# EAGLE design lpc812 (EAGLE 6.4)
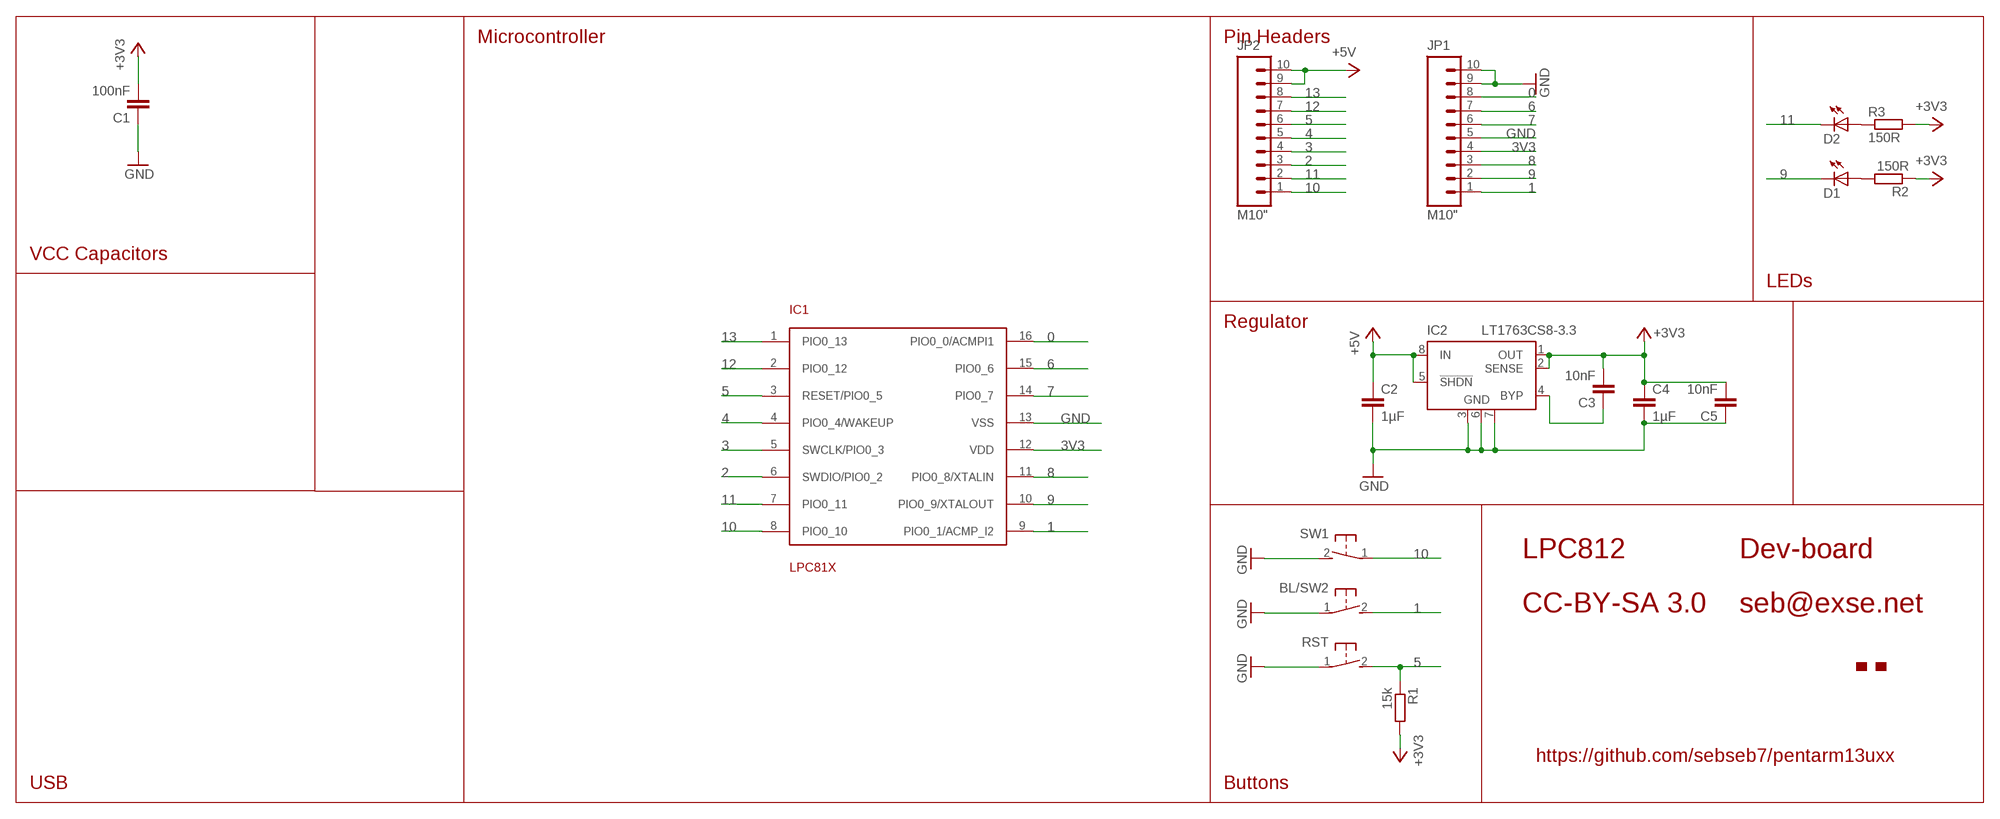
[diagram p0: schematic, sheet 1]

## Parts
BL/SW2  SWITCH_MCTAEF  [SWITCH_MCTAEF]
C1  100nF  C-EUC0402  [C0402]
C2  1µF  CAP0805  [0805]
C3  10nF  C-EUC0402  [C0402]
C4  1µF  CAP0805  [0805]
C5  10nF  C-EUC0402  [C0402]
D1  LEDCHIPLED_0805  [CHIPLED_0805]
D2  LEDCHIPLED_0805  [CHIPLED_0805]
IC1  LPC81X  [TSSOP16]
IC2  LT1763CS8-3.3  [SOIC8]
JP1  M10"  [1X10]
JP2  M10"  [1X10]
R1  15k  R-EU_R0402  [R0402]
R2  150R  R-EU_R0402  [R0402]
R3  150R  R-EU_R0402  [R0402]
RST  SWITCH_MCTAEF  [SWITCH_MCTAEF]
SW1  SWITCH_MCTAEF  [SWITCH_MCTAEF]
U$1  MAKE-DD_LOGO'PROMPT'  [MAKE-DD_LOGO_PROMPT]

## Nets
0: IC1.16(PIO0_0/ACMPI1) JP1.8
1: BL/SW2.2 IC1.9(PIO0_1/ACMP_I2) JP1.1
2: IC1.6(SWDIO/PIO0_2) JP2.3
3: IC1.5(SWCLK/PIO0_3) JP2.4
3V3: C1.2 C3.2 C4.1 C5.2 IC1.12(VDD) IC2.1(OUT) IC2.2(SENSE) JP1.4 R1.2 R2.1 R3.2 ; supply symbol labelled +3V3
4: IC1.4(PIO0_4/WAKEUP) JP2.5
5: IC1.3(RESET/PIO0_5) JP2.6 R1.1 RST.2
6: IC1.15(PIO0_6) JP1.7
7: IC1.14(PIO0_7) JP1.6
8: IC1.11(PIO0_8/XTALIN) JP1.3
9: D1.C IC1.10(PIO0_9/XTALOUT) JP1.2
10: IC1.8(PIO0_10) JP2.1 SW1.1
11: D2.C IC1.7(PIO0_11) JP2.2
12: IC1.2(PIO0_12) JP2.7
13: IC1.1(PIO0_13) JP2.8
+5V: C2.1 IC2.5(!SHDN) IC2.8(IN) JP2.9 JP2.10
GND: BL/SW2.1 C1.1 C2.2 C4.2 C5.1 IC1.13(VSS) IC2.3(GND) IC2.6(GND) IC2.7(GND) JP1.5 JP1.9 JP1.10 RST.1 SW1.2
N$13: C3.1 IC2.4(BYP)
N$18: D1.A R2.2
N$22: D2.A R3.1

## Notes on the sheet
- Microcontroller | Pin Headers
- VCC Capacitors
- LEDs
- Regulator
- LPC812 | Dev-board
- CC-BY-SA 3.0 | seb@exse.net
- https://github.com/sebseb7/pentarm13uxx
- USB | Buttons

## Library data of the parts
BL/SW2 RST SW1 = seb:SWITCH_MCTAEF
C1 C3 C5 = rcl:C-EU: CAPACITOR, European symbol
C2 C4 = SparkFun:CAP: Capacitor Standard 0603 ceramic capacitor, and 0.1" leaded capacitor.
D1 D2 = led:LED: LED OSRAM: - CHIPLED LG R971, LG N971, LY N971, LG Q971, LY Q971, LO R971, LY R971 LH N974, LH R974 LS Q976, LO Q976, LY Q976 LO Q996 - Hyper CHIPLED LW Q18S LB Q993, LB Q99A, LB R99A - SideLED LS A670, LO A670, LY A670, LG A670, LP A670 LB A673, LV A673, LT A673, LW A673 LH A674 LY A675 LS A676, LA A676, LO A676, LY A676, LW A676 LS A679, LY A679, LG A679 - Hyper Micro SIDELED® LS Y876, LA Y876, LO Y876, LY Y876 LT Y87S - SmartLED LW L88C, LW L88S LB L89C, LB L89S, LG L890 LS L89K, LO L89K, LY L89K LS L896, LA L896, LO L896, LY L896 - TOPLED LS T670, LO T670, LY T670, LG T670, LP T670 LSG T670, LSP T670, LSY T670, LOP T670, LYG T670 LG T671, LOG T671, LSG T671 LB T673, LV T673, LT T673, LW T673 LH T674 LS T676, LA T676, LO T676, LY T676, LB T676, LH T676, LSB T676, LW T676 LB T67C, LV T67C, LT T67C, LS T67K, LO T67K, LY T67K, LW E67C LS E67B, LA E67B, LO E67B, LY E67B, LB E67C, LV E67C, LT E67C LW T67C LS T679, LY T679, LG T679 LS T770, LO T770, LY T770, LG T770, LP T770 LB T773, LV T773, LT T773, LW T773 LH T774 LS E675, LA E675, LY E675, LS T675 LS T776, LA T776, LO T776, LY T776, LB T776 LHGB T686 LT T68C, LB T68C - Hyper Mini TOPLED® LB M676 - Mini TOPLED Santana® LG M470 LS M47K, LO M47K, LY M47K Source: http://www.osram.convergy.de LUXEON: - LUMILED® LXK2-PW12-R00, LXK2-PW12-S00, LXK2-PW14-U00, LXK2-PW14-V00 LXK2-PM12-R00, LXK2-PM12-S00, LXK2-PM14-U00 LXK2-PE12-Q00, LXK2-PE12-R00, LXK2-PE12-S00, LXK2-PE14-T00, LXK2-PE14-U00 LXK2-PB12-K00, LXK2-PB12-L00, LXK2-PB12-M00, LXK2-PB14-N00, LXK2-PB14-P00, LXK2-PB14-Q00 LXK2-PR12-L00, LXK2-PR12-M00, LXK2-PR14-Q00, LXK2-PR14-R00 LXK2-PD12-Q00, LXK2-PD12-R00, LXK2-PD12-S00 LXK2-PH12-R00, LXK2-PH12-S00 LXK2-PL12-P00, LXK2-PL12-Q00, LXK2-PL12-R00 Source: www.luxeon.com KINGBRIGHT: KA-3528ASYC Source: www.kingbright.com
IC1 = seb:LPC81X
IC2 = linear-technology:LT1763CS8: 500mA, Low Noise, LDO Micropower Regulators Source: http://cds.linear.com/docs/Datasheet/1763ff.pdf
JP1 JP2 = SparkFun-Connectors:M10: Header 10 Standard 10-pin 0.1" header. Use with straight break away headers (SKU : PRT-00116), right angle break away headers (PRT-00553), swiss pins (PRT-00743), machine pins (PRT-00117), and female headers (PRT-00115).
R1-R3 = rcl:R-EU_: RESISTOR, European symbol
U$1 = seb:MAKE-DD_LOGO

## Board
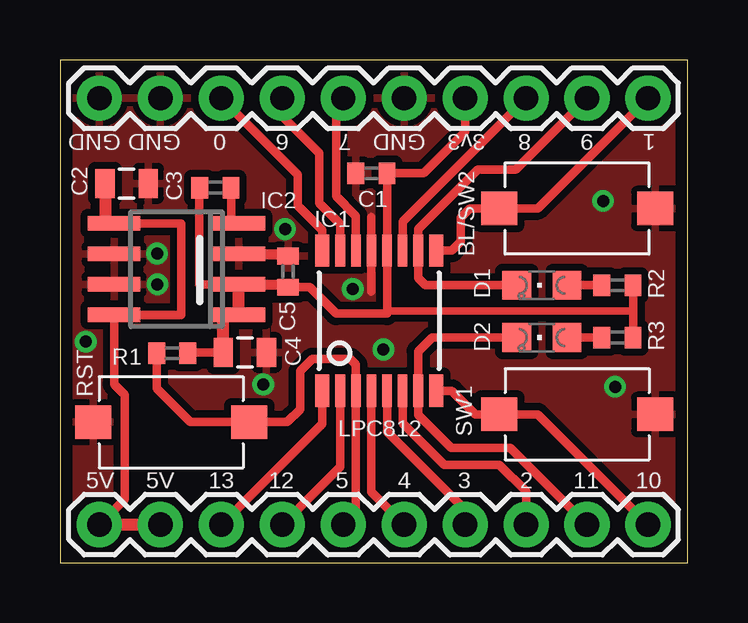
[diagram p1: board, top side]
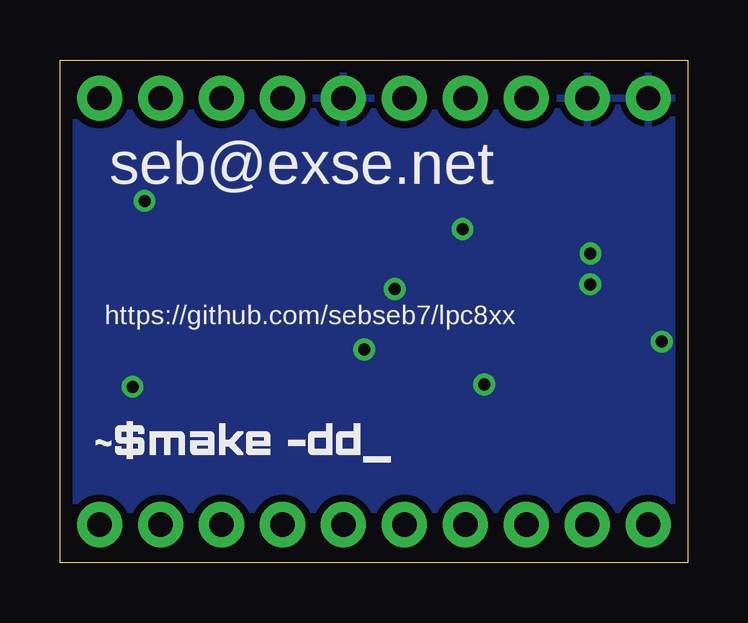
[diagram p2: board, bottom side, seen from below]

Size 26.15 x 20.97 mm. Coordinates in mm from the lower left corner, seen from the top.
Outline: 0,0 26.15,0 26.15,20.97 0,20.97 0,0
Copper layers (1*16): Top 0.035mm / dielectric 1.5mm / Bottom 0.035mm
Design rules "default": minimum track width 8mil, minimum drill 0.4mm, track to track 8mil, track to pad 8mil, pad to pad 8mil, via to via 8mil, smd to smd 8mil, copper to edge 20mil, drill to drill 8mil, minimum pad ring 10mil, minimum via ring 8mil, stop-mask expansion 4mil, vias tented up to drill 40mil, thermal gap 10mil

### Footprints (pad centres in the part's own frame; a part is rotated, then mirrored left to right if it is on the bottom)
SWITCH_MCTAEF = smd 1.5 x 1.4: 1 -3.25,0; 2 3.25,0
C0402 = smd 0.7 x 0.9: 1 -0.65,0; 2 0.65,0
0805 = smd 0.8 x 1.2: 1 -0.9,0; 2 0.9,0
CHIPLED_0805 = smd 1.2 x 1.2: A 0,-1.05; C 0,1.05
TSSOP16 = smd 0.6 x 1.35: 1 -2.375,-2.925; 8 2.375,-2.925; 9 2.375,2.925; 16 -2.375,2.925 | smd 0.4 x 1.35: 2 -1.625,-2.925; 3 -0.975,-2.925; 4 -0.325,-2.925; 5 0.325,-2.925; 6 0.975,-2.925; 7 1.625,-2.925; 10 1.625,2.925; 11 0.975,2.925; 12 0.325,2.925; 13 -0.325,2.925; 14 -0.975,2.925; 15 -1.625,2.925
SOIC8 = smd 0.6 x 2.2: 1 -1.905,-2.6; 2 -0.635,-2.6; 3 0.635,-2.6; 4 1.905,-2.6; 5 1.905,2.6; 6 0.635,2.6; 7 -0.635,2.6; 8 -1.905,2.6
1X10 = drill 1.016 pad 1.88: 1 0,0; 2 2.54,0; 3 5.08,0; 4 7.62,0; 5 10.16,0; 6 12.7,0; 7 15.24,0; 8 17.78,0; 9 20.32,0; 10 22.86,0
R0402 = smd 0.7 x 0.9: 1 -0.65,0; 2 0.65,0

### Placement (x,y rotation side)
BL/SW2  21.55,14.78 180 top
C1  12.98,16.25 0 top
C2  2.78,15.82 0 top
C3  6.48,15.65 180 top
C4  7.7,8.77 0 top
C5  9.5,12.15 270 top
D1  20.08,11.58 90 top
D2  20.08,9.4 90 top
IC1  13.3,10.1 0 top
IC2  4.85,12.25 90 top
JP1  24.5,19.38 180 top
JP2  24.5,1.6 180 top
R1  4.68,8.75 0 top
R2  23.23,11.58 180 top
R3  23.23,9.4 0 top
RST  4.62,5.88 0 top
SW1  21.55,6.2 0 top
U$1  24.5,4.5 0 bottom

### Tracks (layer width: path | path; a pad name or v marks a point on that pad's centre or on a via)
0
  Top 0.35: IC1.16 10.93,13.88 9.9,14.9 9.9,16.2 JP1.8
1
  Top 0.35: JP1.1 19.9,14.78 BL/SW2.2 17.08,14.78 16.7,14.4 16.7,13.4 16.32,13.02 IC1.9
2
  Top 0.35: IC1.6 14.27,5.83 16,4.1 18.3,4.1 19.42,2.98 JP2.3
3
  Top 0.35: IC1.5 13.62,5.48 16.88,2.22 JP2.4
3V3
  Top 0.305: R2.1 23.88,10.5 13.62,10.5 13.62,10.4
  Top 0.35: R2.1 R3.2 | JP1.4 16.88,17.98 15.15,16.25 C1.2 IC1.12 13.62,10.4 11.5,10.4 10.4,11.5 C5.2 | IC2.2 5.8,11.61 5.8,15.65 C3.2 | R1.2 5.35,8.77 C4.1
  Top 0.406: IC2.2 9.29,11.61 C5.2
  Top 0.5: C4.1 6.8,10.34 IC2.1 IC2.2
4
  Top 0.35: IC1.4 12.98,2.96 JP2.5
5
  Top 0.35: JP2.6 12.32,2.12 IC1.3 12.32,8.27 12.1,8.5 10.5,8.5 10,8 10,6.4 9.48,5.88 RST.2 5.43,5.88 4.02,7.27 R1.1
6
  Top 0.35: IC1.15 11.68,14.12 10.8,15 10.8,17.1 9.26,18.64 JP1.7
7
  Top 0.35: IC1.14 12.32,14.47 11.5,15.3 11.5,19.08 JP1.6
8
  Top 0.35: JP1.3 14.27,14.23 IC1.11
9
  Top 0.35: JP1.2 18.98,16.4 17.4,16.4 14.93,13.93 IC1.10 14.93,11.88 15.22,11.58 D1.C
10
  Top 0.35: JP2.1 19.9,6.2 SW1.1 17.3,6.2 16.32,7.17 IC1.8
11
  Top 0.35: JP2.2 18.76,4.8 16.3,4.8 14.93,6.17 IC1.7 14.93,8.82 15.5,9.4 D2.C
12
  Top 0.35: IC1.2 11.68,4.02 JP2.7
13
  Top 0.35: IC1.1 10.93,5.81 JP2.8
+5V
  Top 0.35: IC2.5 5.05,14.15 5.05,10.34 IC2.8 2.25,7.45 2.7,7 2.7,2.66 JP2.10
  Top 0.5: C2.1 1.88,14.15 IC2.5 | JP2.9 JP2.10
GND  (via drill 0.5)
  Top 0.35: 12.98,14.43 IC1.13 12.98,11.32
  Top 0.406: IC2.3 9.32,12.88 C5.1
  other vias: 23.12,7.35 22.62,15.1 13.48,8.9 12.2,11.43 4.06,11.62 1.07,9.23 9.38,13.93 4.05,12.9 8.47,7.44
  pour Top (isolate 0.305): -0.15,-0.1 26.05,0.08 26.25,21.12 0.05,20.95
  pour Bottom (isolate 0.305): -0.07,-0.1 26.15,-0.02 26.15,21.02 -0.07,20.95
N$13
  Top 0.35: IC2.4 7.12,14.15 C3.1
N$18
  Top 0.35: D1.A R2.2
N$22
  Top 0.35: D2.A R3.1

### Text on the board
bPlace: seb@exse.net | https://github.com/sebseb7/lpc8xx
tNames: GND | GND | 0 | 6 | 7 | GND | 3v3 | 8 | 9 | 1 | LPC812 | 5V | 5V | 13 | 12 | 5 | 4 | 3 | 2 | 11 | 10